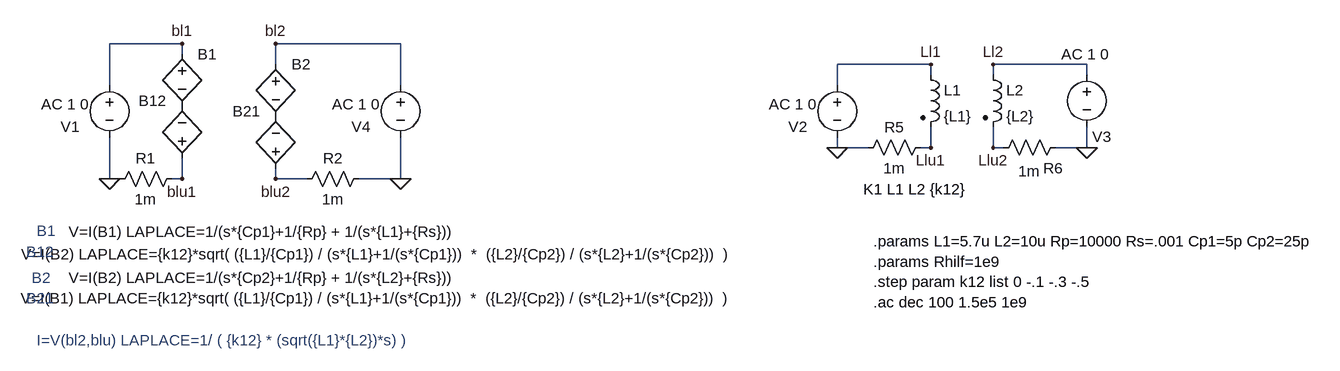
[diagram p0: schematic inductance_as_bv.asc]
inductance_as_bv.asc, the LTspice schematic file:
Version 4
SHEET 1 1672 680
WIRE -288 -176 -400 -176
WIRE 48 -176 -144 -176
WIRE -288 -160 -288 -176
WIRE -144 -144 -144 -176
WIRE 864 -144 720 -144
WIRE 1104 -144 960 -144
WIRE 864 -128 864 -144
WIRE 960 -128 960 -144
WIRE 1104 -128 1104 -144
WIRE -400 -112 -400 -176
WIRE 48 -112 48 -176
WIRE 720 -112 720 -144
WIRE 720 -16 720 -32
WIRE 768 -16 720 -16
WIRE 864 -16 864 -48
WIRE 864 -16 848 -16
WIRE 960 -16 960 -48
WIRE 976 -16 960 -16
WIRE 1104 -16 1104 -48
WIRE 1104 -16 1056 -16
WIRE -400 32 -400 -32
WIRE -384 32 -400 32
WIRE -288 32 -288 0
WIRE -288 32 -304 32
WIRE -144 32 -144 16
WIRE -96 32 -144 32
WIRE 48 32 48 -32
WIRE 48 32 -16 32
FLAG -400 32 0
FLAG -288 -176 bl1
FLAG -288 32 blu1
FLAG -144 -176 bl2
FLAG 720 -16 0
FLAG 864 -144 Ll1
FLAG 864 -16 Llu1
FLAG 960 -144 Ll2
FLAG 48 32 0
FLAG 1104 -16 0
FLAG -144 32 blu2
FLAG 960 -16 Llu2
SYMBOL res -288 16 R90
WINDOW 0 0 56 VBottom 0
WINDOW 3 32 56 VTop 0
SYMATTR InstName R1
SYMATTR Value 1m
SYMBOL voltage -400 -128 R0
WINDOW 0 -75 80 Left 0
WINDOW 123 -105 45 Left 0
WINDOW 39 0 0 Left 0
SYMATTR InstName V1
SYMATTR Value2 AC 1 0
SYMATTR Value ""
SYMBOL res 864 -32 R90
WINDOW 0 0 56 VBottom 0
WINDOW 3 32 56 VTop 0
SYMATTR InstName R5
SYMATTR Value 1m
SYMBOL voltage 720 -128 R0
WINDOW 0 -75 80 Left 0
WINDOW 123 -105 45 Left 0
WINDOW 39 0 0 Left 0
SYMATTR InstName V2
SYMATTR Value2 AC 1 0
SYMATTR Value ""
SYMBOL ind2 848 -144 R0
SYMATTR InstName L1
SYMATTR Value {L1}
SYMATTR Type ind
SYMATTR SpiceLine Rser={Rs} Rpar={Rp} Cpar={Cp1}
SYMBOL ind2 944 -144 R0
SYMATTR InstName L2
SYMATTR Value {L2}
SYMATTR Type ind
SYMATTR SpiceLine Rser={Rs} Rpar={Rp} Cpar={Cp2}
SYMBOL bv -288 -176 R0
WINDOW 3 -175 289 Left 0
SYMATTR InstName B1
SYMATTR Value V=I(B1) LAPLACE=1/(s*{Cp1}+1/{Rp} + 1/(s*{L1}+{Rs}))
SYMBOL bv -288 16 R180
WINDOW 0 24 104 Left 0
WINDOW 3 -864 -132 Left 0
SYMATTR InstName B12
SYMATTR Value V=I(B2) LAPLACE={k12}*sqrt( ({L1}/{Cp1}) / (s*{L1}+1/(s*{Cp1}))  *  ({L2}/{Cp2}) / (s*{L2}+1/(s*{Cp2}))  )
SYMBOL bv -144 -160 R0
WINDOW 3 -319 344 Left 0
SYMATTR InstName B2
SYMATTR Value V=I(B2) LAPLACE=1/(s*{Cp2}+1/{Rp} + 1/(s*{L2}+{Rs}))
SYMBOL bv -144 32 R180
WINDOW 0 24 104 Left 0
WINDOW 3 -719 -184 Left 0
SYMATTR InstName B21
SYMATTR Value V=I(B1) LAPLACE={k12}*sqrt( ({L1}/{Cp1}) / (s*{L1}+1/(s*{Cp1}))  *  ({L2}/{Cp2}) / (s*{L2}+1/(s*{Cp2}))  )
SYMBOL voltage 1104 -144 R0
WINDOW 0 9 111 Left 0
WINDOW 123 -39 -16 Left 0
WINDOW 39 0 0 Left 0
SYMATTR InstName V3
SYMATTR Value2 AC 1 0
SYMATTR Value ""
SYMBOL voltage 48 -128 R0
WINDOW 0 -75 80 Left 0
WINDOW 123 -105 45 Left 0
WINDOW 39 0 0 Left 0
SYMATTR InstName V4
SYMATTR Value2 AC 1 0
SYMATTR Value ""
SYMBOL res 0 16 R90
WINDOW 0 0 56 VBottom 0
WINDOW 3 32 56 VTop 0
SYMATTR InstName R2
SYMATTR Value 1m
SYMBOL res 1072 -32 R90
WINDOW 0 63 19 VBottom 0
WINDOW 3 37 56 VTop 0
SYMATTR InstName R6
SYMATTR Value 1m
TEXT 776 128 Left 0 !.params L1=5.7u L2=10u Rp=10000 Rs=.001 Cp1=5p Cp2=25p\n.params Rhilf=1e9\n.step param k12 list 0 -.1 -.3 -.5\n.ac dec 100 1.5e5 1e9
TEXT -512 112 Left 0 ;B1
TEXT -520 184 Left 0 ;B2
TEXT -528 144 Left 0 ;B12
TEXT -528 216 Left 0 ;B21
TEXT 760 48 Left 0 !K1 L1 L2 {k12}
TEXT -512 280 Left 0 ;I=V(bl2,blu) LAPLACE=1/ ( {k12} * (sqrt({L1}*{L2})*s) )

The netlist it stands for:
* inductance_as_bv.asc
R1 blu1 0 1m
V1 bl1 0 AC 1 0
R5 Llu1 0 1m
V2 Ll1 0 AC 1 0
L1 Ll1 Llu1 {L1} Rser={Rs} Rpar={Rp} Cpar={Cp1}
L2 Ll2 Llu2 {L2} Rser={Rs} Rpar={Rp} Cpar={Cp2}
B1 bl1 P001 V=I(B1) LAPLACE=1/(s*{Cp1}+1/{Rp} + 1/(s*{L1}+{Rs}))
B12 blu1 P001 V=I(B2) LAPLACE={k12}*sqrt( ({L1}/{Cp1}) / (s*{L1}+1/(s*{Cp1}))  *  ({L2}/{Cp2}) / (s*{L2}+1/(s*{Cp2}))  )
B2 bl2 P002 V=I(B2) LAPLACE=1/(s*{Cp2}+1/{Rp} + 1/(s*{L2}+{Rs}))
B21 blu2 P002 V=I(B1) LAPLACE={k12}*sqrt( ({L1}/{Cp1}) / (s*{L1}+1/(s*{Cp1}))  *  ({L2}/{Cp2}) / (s*{L2}+1/(s*{Cp2}))  )
V3 Ll2 0 AC 1 0
V4 bl2 0 AC 1 0
R2 0 blu2 1m
R6 0 Llu2 1m
.params L1=5.7u L2=10u Rp=10000 Rs=.001 Cp1=5p Cp2=25p
.params Rhilf=1e9
.step param k12 list 0 -.1 -.3 -.5
.ac dec 100 1.5e5 1e9
* B1
* B2
* B12
* B21
K1 L1 L2 {k12}
* I=V(bl2,blu) LAPLACE=1/ ( {k12} * (sqrt({L1}*{L2})*s) )
.backanno
.end